# EAGLE design HMI_Board (EAGLE 7.7.0)
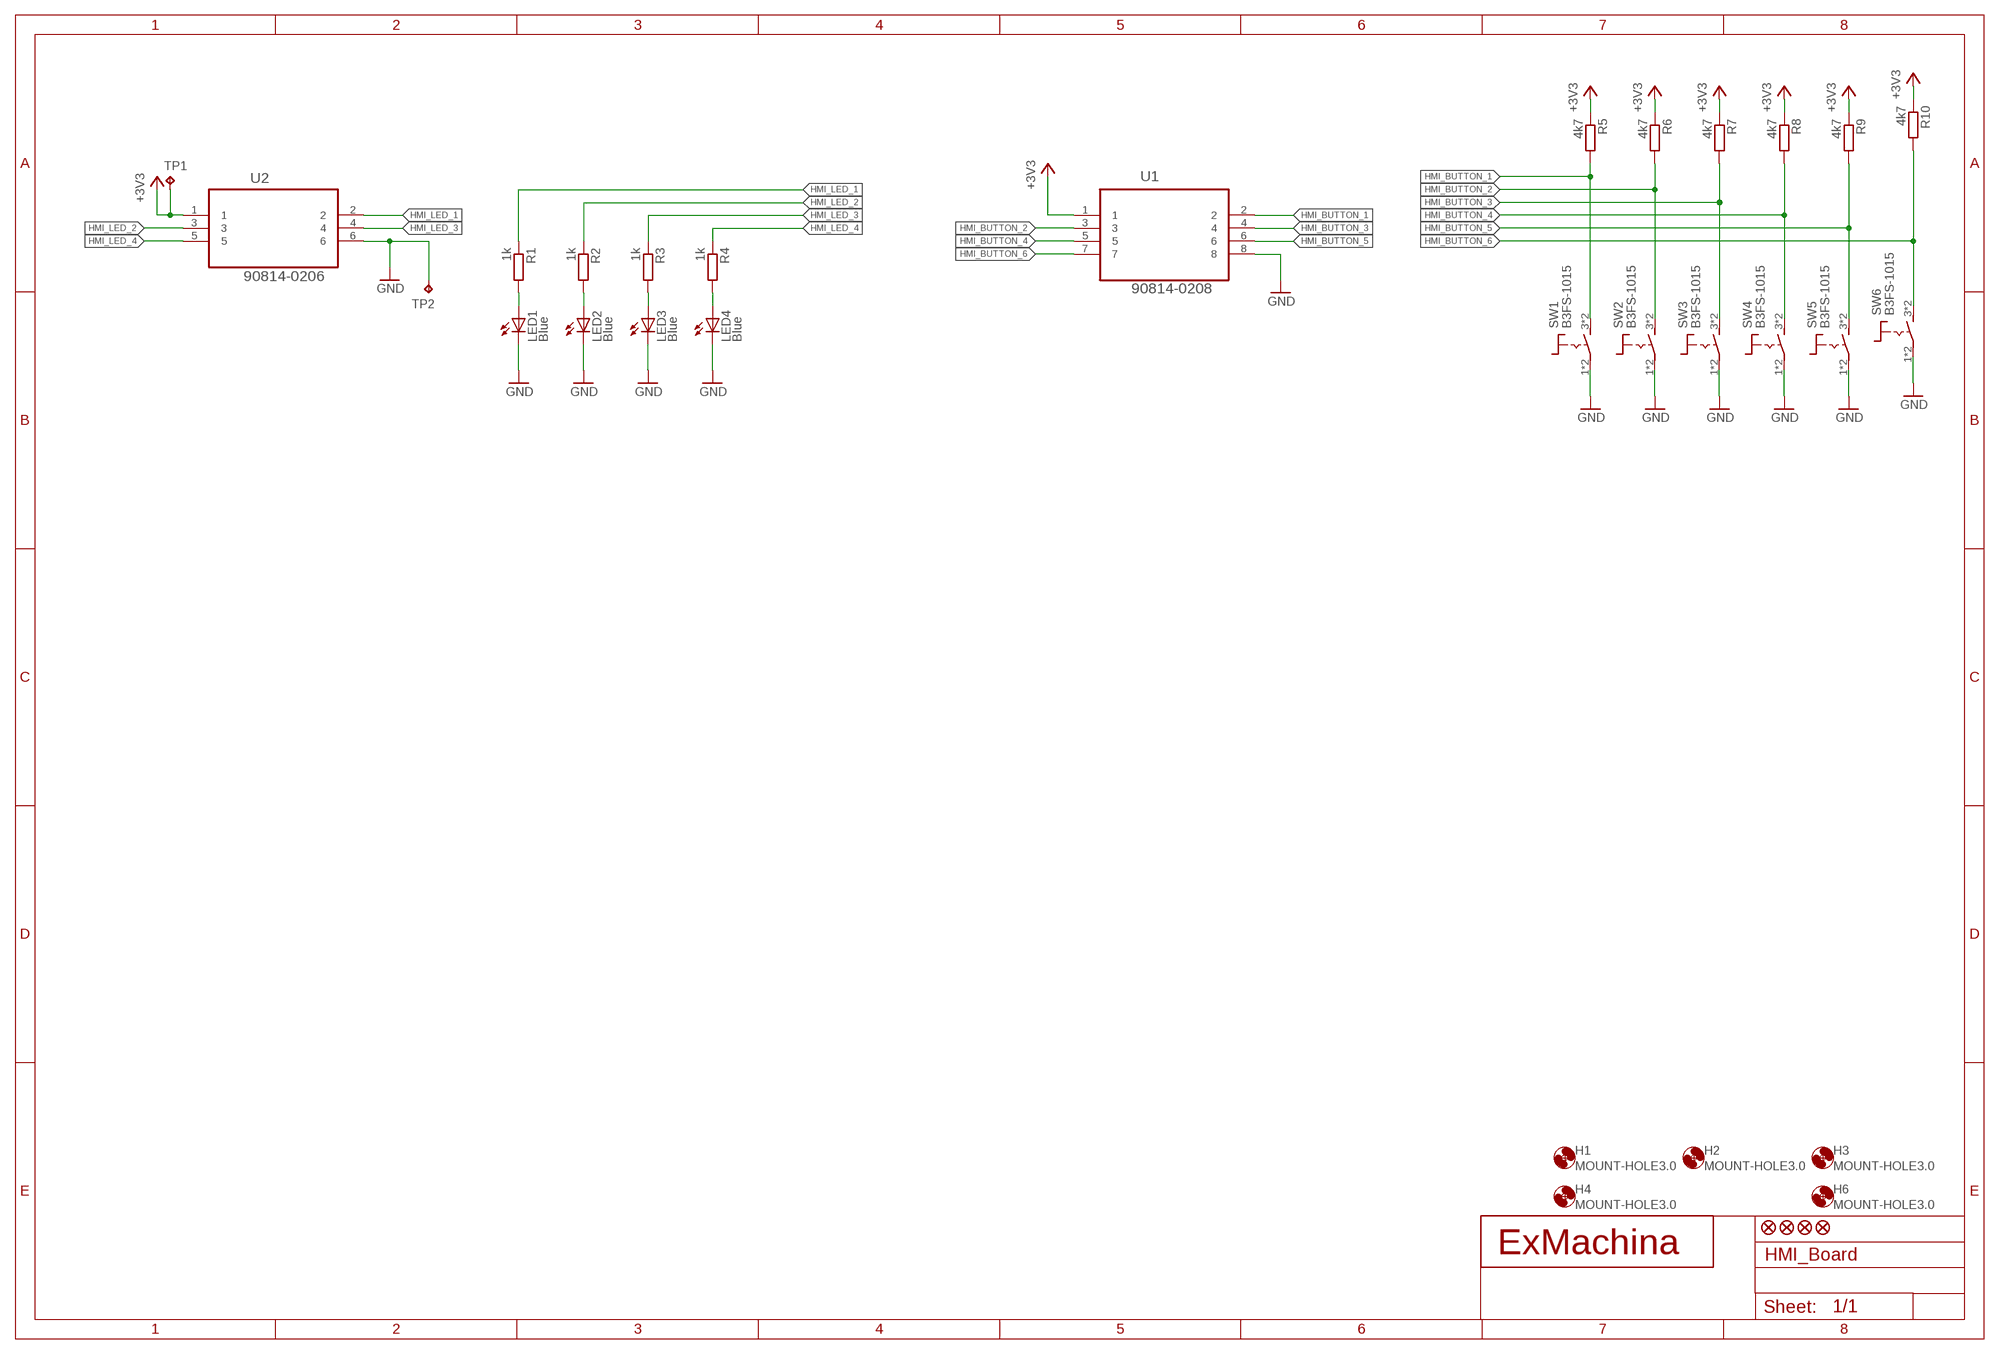
[diagram p0: schematic, sheet 1]

## Parts
H1  MOUNT-HOLE3.0  [3,0]
H2  MOUNT-HOLE3.0  [3,0]
H3  MOUNT-HOLE3.0  [3,0]
H4  MOUNT-HOLE3.0  [3,0]
H6  MOUNT-HOLE3.0  [3,0]
JP1  FIDUCIAL1X2  [FIDUCIAL-1X2]
JP2  FIDUCIAL1X2  [FIDUCIAL-1X2]
JP3  FIDUCIAL1X2  [FIDUCIAL-1X2]
JP4  FIDUCIAL1X2  [FIDUCIAL-1X2]
LED1  Blue  LEDSML0603  [SML0603]
LED2  Blue  LEDSML0603  [SML0603]
LED3  Blue  LEDSML0603  [SML0603]
LED4  Blue  LEDSML0603  [SML0603]
R1  1k  R-EU_R0603  [R0603]
R2  1k  R-EU_R0603  [R0603]
R3  1k  R-EU_R0603  [R0603]
R4  1k  R-EU_R0603  [R0603]
R5  4k7  R-EU_R0603  [R0603]
R6  4k7  R-EU_R0603  [R0603]
R7  4k7  R-EU_R0603  [R0603]
R8  4k7  R-EU_R0603  [R0603]
R9  4k7  R-EU_R0603  [R0603]
R10  4k7  R-EU_R0603  [R0603]
SW1  B3FS-1015  [B3FS]
SW2  B3FS-1015  [B3FS]
SW3  B3FS-1015  [B3FS]
SW4  B3FS-1015  [B3FS]
SW5  B3FS-1015  [B3FS]
SW6  B3FS-1015  [B3FS]
TP1  TPB2,54  [B2,54]
TP2  TPB2,54  [B2,54]
U1  90814-0208  [MOLEX_90814-0208]
U2  90814-0206  [MOLEX_90814-0206]
U$1  EXMACHINA-LOGO-NAME  [EXM-LOGO-BASELINE]

## Nets
+3V3: R5.1 R6.1 R7.1 R8.1 R9.1 R10.1 TP1.TP U1.1 U2.1
GND [supply]: LED1.C LED2.C LED3.C LED4.C SW1.1 SW1.2 SW2.1 SW2.2 SW3.1 SW3.2 SW4.1 SW4.2 SW5.1 SW5.2 SW6.1 SW6.2 TP2.TP U1.8 U2.6
HMI_BUTTON_1 [signal]: R5.2 SW1.3 SW1.4 U1.2
HMI_BUTTON_2 [signal]: R6.2 SW2.3 SW2.4 U1.3
HMI_BUTTON_3 [signal]: R7.2 SW3.3 SW3.4 U1.4
HMI_BUTTON_4 [signal]: R8.2 SW4.3 SW4.4 U1.5
HMI_BUTTON_5 [signal]: R9.2 SW5.3 SW5.4 U1.6
HMI_BUTTON_6 [signal]: R10.2 SW6.3 SW6.4 U1.7
HMI_LED_1 [signal]: R1.1 U2.2
HMI_LED_2 [signal]: R2.1 U2.3
HMI_LED_3 [signal]: R3.1 U2.4
HMI_LED_4 [signal]: R4.1 U2.5
N$1: LED1.A R1.2
N$2: LED2.A R2.2
N$3: LED3.A R3.2
N$4: LED4.A R4.2

## Library data of the parts
H1-H4 H6 = holes:MOUNT-HOLE: MOUNTING HOLE with drill center marker
JP1-JP4 = SparkFun:FIDUCIAL: Fiducial Alignment Points Various fiducial points for machine vision alignment.
LED1-LED4 = led:LED: LED OSRAM: - CHIPLED LG R971, LG N971, LY N971, LG Q971, LY Q971, LO R971, LY R971 LH N974, LH R974 LS Q976, LO Q976, LY Q976 LO Q996 - Hyper CHIPLED LW Q18S LB Q993, LB Q99A, LB R99A - SideLED LS A670, LO A670, LY A670, LG A670, LP A670 LB A673, LV A673, LT A673, LW A673 LH A674 LY A675 LS A676, LA A676, LO A676, LY A676, LW A676 LS A679, LY A679, LG A679 - Hyper Micro SIDELED® LS Y876, LA Y876, LO Y876, LY Y876 LT Y87S - SmartLED LW L88C, LW L88S LB L89C, LB L89S, LG L890 LS L89K, LO L89K, LY L89K LS L896, LA L896, LO L896, LY L896 - TOPLED LS T670, LO T670, LY T670, LG T670, LP T670 LSG T670, LSP T670, LSY T670, LOP T670, LYG T670 LG T671, LOG T671, LSG T671 LB T673, LV T673, LT T673, LW T673 LH T674 LS T676, LA T676, LO T676, LY T676, LB T676, LH T676, LSB T676, LW T676 LB T67C, LV T67C, LT T67C, LS T67K, LO T67K, LY T67K, LW E67C LS E67B, LA E67B, LO E67B, LY E67B, LB E67C, LV E67C, LT E67C LW T67C LS T679, LY T679, LG T679 LS T770, LO T770, LY T770, LG T770, LP T770 LB T773, LV T773, LT T773, LW T773 LH T774 LS E675, LA E675, LY E675, LS T675 LS T776, LA T776, LO T776, LY T776, LB T776 LHGB T686 LT T68C, LB T68C - Hyper Mini TOPLED® LB M676 - Mini TOPLED Santana® LG M470 LS M47K, LO M47K, LY M47K Source: http://www.osram.convergy.de LUXEON: - LUMILED® LXK2-PW12-R00, LXK2-PW12-S00, LXK2-PW14-U00, LXK2-PW14-V00 LXK2-PM12-R00, LXK2-PM12-S00, LXK2-PM14-U00 LXK2-PE12-Q00, LXK2-PE12-R00, LXK2-PE12-S00, LXK2-PE14-T00, LXK2-PE14-U00 LXK2-PB12-K00, LXK2-PB12-L00, LXK2-PB12-M00, LXK2-PB14-N00, LXK2-PB14-P00, LXK2-PB14-Q00 LXK2-PR12-L00, LXK2-PR12-M00, LXK2-PR14-Q00, LXK2-PR14-R00 LXK2-PD12-Q00, LXK2-PD12-R00, LXK2-PD12-S00 LXK2-PH12-R00, LXK2-PH12-S00 LXK2-PL12-P00, LXK2-PL12-Q00, LXK2-PL12-R00 Source: www.luxeon.com KINGBRIGHT: KA-3528ASYC Source: www.kingbright.com
R1-R10 = rcl:R-EU_: RESISTOR, European symbol
SW1-SW6 = Switch_SMT:B3FS: Surface-mounting Switches Ideal for High-density Mounting
TP1 TP2 = testpad:TP: Test pad
U1 = Molex_By_element14_Batch_1:90814-0208: CONN HEADER 8POS 1.27MM SMD TIN; MPN: 90814-0208; OC_FARNELL: 1757025; OC_NEWARK: 34R6216; PACKAGE: CONN-8POS; SUPPLIER: Molex
U2 = Molex_By_element14_Batch_1:90814-0206: CONN HEADER 06 POS 1.27MM SMD TIN; MPN: 90814-0206; OC_FARNELL: 1757024; OC_NEWARK: 34R6215; PACKAGE: CONN-6 POS; SUPPLIER: Molex
U$1 = exmachina:EXMACHINA-LOGO

## Net classes
1 signal: width 0.178 mm, drill 0.35 mm
2 supply: width 0.406 mm, drill 0.5 mm

## Board
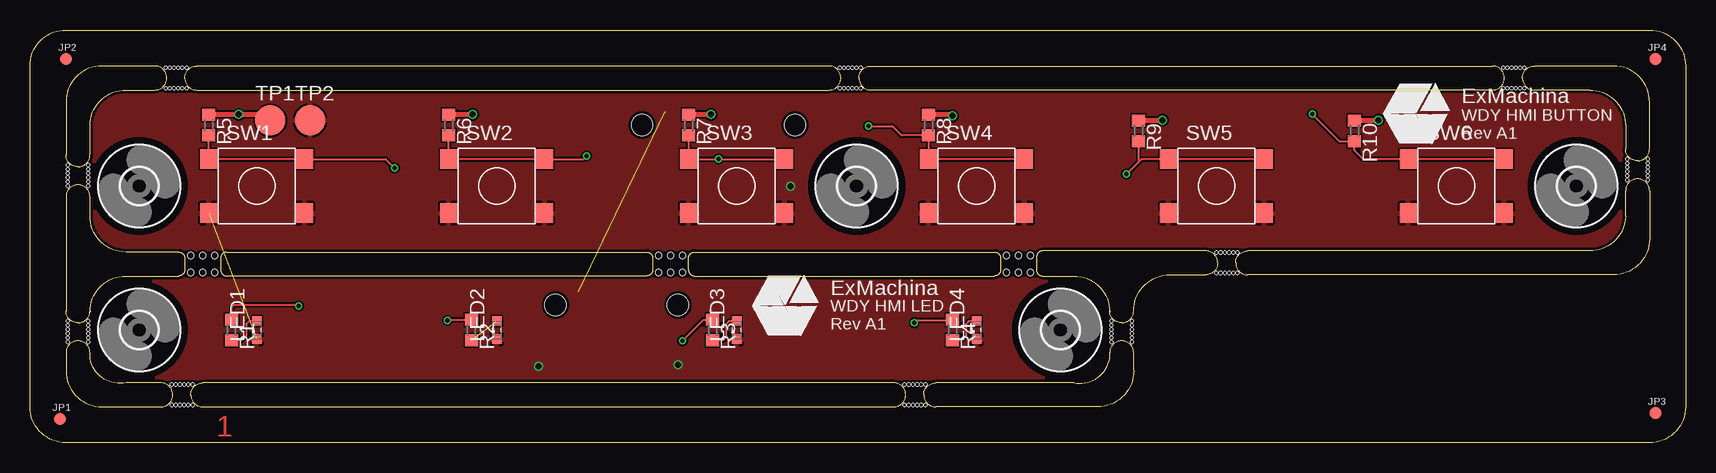
[diagram p1: board, top side]
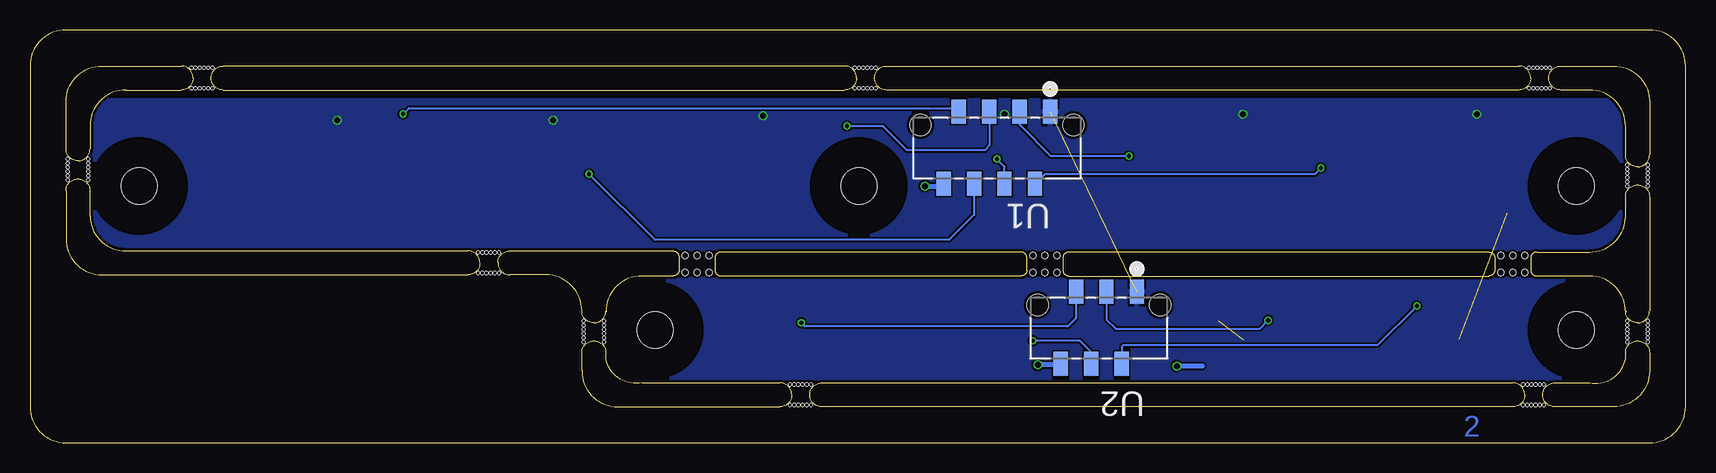
[diagram p2: board, bottom side, seen from below]

Size 138 x 34.4 mm. Coordinates in mm from the lower left corner, seen from the top.
Outline: 10.9,5 8,5 arc-90 5,7 5,7.5 arc90 4,8.5 arc90 3,7.5 3,6 arc90 6,3 10.9,3 arc90 11.9,4 arc90 10.9,5
Outline: 87,5 arc90 90,7 90,7.5 arc-90 91,8.5 arc-90 92,7.5 92,6 arc-90 89,3 75.5,3 arc-90 74.5,4 arc-90 75.5,5 87,5
Outline: 84.4,13.9 87,13.9 arc-90 90,10.9 90,11 arc90 91,10 arc90 92,11 arc-90 95,14 98,14 arc90 99,15 arc90 98,16 84.4,16 arc90 83.9,15.4 83.9,14.4 arc90 84.4,13.9
Outline: 15.9,15.4 15.9,14.4 arc90 16.4,13.9 51.4,13.9 arc90 51.9,14.4 51.9,15.4 arc90 51.4,15.9 16.4,15.9 arc90 15.9,15.4
Outline: 80.9,15.4 80.9,14.4 arc-90 80.4,13.9 55.4,13.9 arc-90 54.9,14.4 54.9,15.4 arc-90 55.4,15.9 80.4,15.9 arc-90 80.9,15.4
Outline: 133,18.9 arc-90 130,16 101.5,16 arc90 100.5,15 arc90 101.5,14 132,14 arc90 135,17 135,21 arc90 134,22 arc90 133,21 133,18.9
Outline: 12.9,15.4 12.9,14.4 arc-90 12.4,13.9 8,13.9 arc90 5,10.9 5,11 arc-90 4,10 arc-90 3,11 3,20.5 arc-90 4,21.5 arc-90 5,20.5 5,18.9 arc90 8,15.9 12.4,15.9 arc-90 12.9,15.4
Outline: 5,24 5,26.4 arc-90 8,29.4 10.4,29.4 arc90 11.4,30.4 arc90 10.4,31.4 6,31.4 arc90 3,28.4 3,24 arc90 4,23 arc90 5,24
Outline: 130,29.4 arc-90 133,26.4 133,24.5 arc90 134,23.5 arc90 135,24.5 135,28.4 arc90 132,31.4 125.4,31.4 arc90 124.4,30.4 arc90 125.4,29.4 130,29.4
Outline: 135,0 3,0 arc-90 0,3 0,31.4 arc-90 3,34.4 135,34.4 arc-90 138,31.4 138,3 arc-90 135,0
Outline: 13.4,4 arc-90 14.4,5 72,5 arc-90 73,4 arc-90 72,3 14.4,3 arc-90 13.4,4
Outline: 121.9,29.4 arc90 122.9,30.4 arc90 121.9,31.4 70.1,31.4 arc90 69.1,30.4 arc90 70.1,29.4 121.9,29.4
Outline: 12.9,30.4 arc-90 13.9,31.4 66.6,31.4 arc-90 67.6,30.4 arc-90 66.6,29.4 13.9,29.4 arc-90 12.9,30.4
Copper layers (1*16): Top 0.018mm / dielectric 1.55mm / Bottom 0.018mm
Design rules "eC_2Layer_PClass6_BaseCopperO18_eCDefault *": minimum track width 0.15mm, minimum drill 0.35mm, track to track 0.15mm, track to pad 0.15mm, pad to pad 0.15mm, via to via 0.15mm, smd to smd 0mil, copper to edge 0.25mm, drill to drill 0.35mm, minimum pad ring 0.175mm, minimum via ring 0.125mm, stop-mask expansion 0mil, vias tented up to drill 0.45mm, thermal gap 0.2mm
Holes 0.5 mm at 13.4,15.6 14.4,15.6 15.4,15.6 15.4,14.2 14.4,14.2 13.4,14.2 81.4,15.6 82.4,15.6 83.4,15.6 83.4,14.2 82.4,14.2 81.4,14.2 52.4,15.6 53.4,15.6 54.4,15.6 54.4,14.2 53.4,14.2 52.4,14.2
Holes 0.25 mm at 90.15,9.1 90.15,8.75 90.15,8.4 90.15,9.45 90.15,9.8 90.15,10.15 91.85,9.1 91.85,8.75 91.85,8.4 91.85,9.45 91.85,9.8 91.85,10.15 99.6,15.85 99.25,15.85 98.9,15.85 99.95,15.85 100.3,15.85 100.65,15.85 99.6,14.15 99.25,14.15 98.9,14.15 99.95,14.15 100.3,14.15 100.65,14.15 12.5,4.85 12.15,4.85 11.8,4.85 12.85,4.85 13.2,4.85 13.55,4.85 12.5,3.15 12.15,3.15 11.8,3.15 12.85,3.15 13.2,3.15 13.55,3.15 73.6,4.85 73.25,4.85 72.9,4.85 73.95,4.85 74.3,4.85 74.65,4.85 73.6,3.15 73.25,3.15 72.9,3.15 73.95,3.15 74.3,3.15 74.65,3.15 123.5,31.25 123.15,31.25 122.8,31.25 123.85,31.25 124.2,31.25 124.55,31.25 123.5,29.55 123.15,29.55 122.8,29.55 123.85,29.55 124.2,29.55 124.55,29.55 12,31.25 11.65,31.25 11.3,31.25 12.35,31.25 12.7,31.25 13.05,31.25 12,29.55 11.65,29.55 11.3,29.55 12.35,29.55 12.7,29.55 13.05,29.55 68.2,31.25 67.85,31.25 67.5,31.25 68.55,31.25 68.9,31.25 69.25,31.25 68.2,29.55 67.85,29.55 67.5,29.55 68.55,29.55 68.9,29.55 69.25,29.55 3.15,9.1 3.15,8.75 3.15,8.4 3.15,9.45 3.15,9.8 3.15,10.15 4.85,9.1 4.85,8.75 4.85,8.4 4.85,9.45 4.85,9.8 4.85,10.15 3.15,22.1 3.15,21.75 3.15,21.4 3.15,22.45 3.15,22.8 3.15,23.15 4.85,22.1 4.85,21.75 4.85,21.4 4.85,22.45 4.85,22.8 4.85,23.15 133.15,22.6 133.15,22.25 133.15,21.9 133.15,22.95 133.15,23.3 133.15,23.65 134.85,22.6 134.85,22.25 134.85,21.9 134.85,22.95 134.85,23.3 134.85,23.65

### Footprints (pad centres in the part's own frame; a part is rotated, then mirrored left to right if it is on the bottom)
3,0 = hole 3: 0,0
FIDUCIAL-1X2 = smd 1 x 1: 1 0,0
SML0603 = smd 0.8 x 0.8: A 0.75,0; C -0.75,0
R0603 = smd 1 x 1.1: 1 -0.85,0; 2 0.85,0
B3FS = smd 1.4 x 1.6: 1 4,-2.25; 2 -4,-2.25; 3 4,2.25; 4 -4,2.25
B2,54 = smd 2.54 x 2.54: TP 0,0
MOLEX_90814-0208 = smd 1.194 x 2.007: 1 -4.445,-3.175; 2 -3.175,2.819; 3 -1.905,-3.175; 4 -0.635,2.819; 5 0.635,-3.175; 6 1.905,2.819; 7 3.175,-3.175; 8 4.445,2.819 | hole 1.753: -6.375,-2.083; 6.375,-2.083
MOLEX_90814-0206 = smd 1.194 x 2.007: 1 -3.175,-3.175; 2 -1.905,2.819; 3 -0.635,-3.175; 4 0.635,2.819; 5 1.905,-3.175; 6 3.175,2.819 | hole 1.753: -5.105,-2.083; 5.105,-2.083

### Placement (x,y rotation side)
H1  128.9,21.4 0 top
H2  68.9,21.4 0 top
H3  9.1,9.4 0 top
H4  85.9,9.4 0 top
H6  9.1,21.4 0 top
JP1  2.5,2 0 top
JP2  3,32 0 top
JP3  135.5,2.5 0 top
JP4  135.5,32 0 top
LED1  18.9,9.4 90 top
LED2  38.9,9.4 90 top
LED3  58.9,9.4 90 top
LED4  78.9,9.4 90 top
R1  16.8,9.4 270 top
R2  36.8,9.4 270 top
R3  56.9,9.4 270 top
R4  76.9,9.4 270 top
R5  14.9,26.47 270 top
R6  34.9,26.47 270 top
R7  54.9,26.47 270 top
R8  74.9,26.47 270 top
R9  92.4,26 270 top
R10  110.4,26 270 top
SW1  18.9,21.4 0 top
SW2  38.9,21.4 0 top
SW3  58.9,21.4 0 top
SW4  78.9,21.4 0 top
SW5  98.9,21.4 0 top
SW6  118.9,21.4 0 top
TP1  20.04,26.86 0 top
TP2  23.35,26.86 0 top
U1  57.4,24.4 180 bottom
U2  48.9,9.4 180 bottom
U$1  62.9,11.4 0 top
U$2  EXMACHINA-LOGO-NAME  [EXM-LOGO-BASELINE]  115.5,27.4 0 top

### Tracks (layer width: path | path; a pad name or v marks a point on that pad's centre or on a via)
+3V3  (via drill 0.5)  (1 unrouted)
  Top 0.406: R5.1 14.95,27.37 v17.4,27.37 20.04,27.37 TP1.TP | R6.1 34.95,27.37 v36.9,27.37 | R10.1 110.45,26.9 v112.4,26.9 | R9.1 92.45,26.9 v94.4,26.9 | R8.1 74.95,27.37 76.77,27.37 v76.9,27.24 | R7.1 54.95,27.37 v56.77,27.37
  pour Bottom: -1.5,28.5 133,28.5 133,-11.5 -2,-11.5 -1.5,12
GND  (via drill 0.5)  (1 unrouted)
  Bottom 0.406: 40.26,6.4 v42.4,6.4 | v63.4,21.4 62.03,21.4 U1.8 | U2.6 52.16,6.5 v54,6.5
  pour Top: 134,35.5 -4,37 -4.5,-15 133.5,-15
HMI_BUTTON_1  (via drill 0.35)
  Top 0.178: R5.2 SW1.4 SW1.3 29.65,23.65 v30.4,22.9
  Bottom 0.178: v30.4,22.9 30.9,22.4 53.41,22.4 U1.2
HMI_BUTTON_2  (via drill 0.35)
  Top 0.178: R6.2 SW2.4 SW2.3 46.15,23.65 v46.4,23.9
  Bottom 0.178: v46.4,23.9 52.9,23.9 55.49,26.5 U1.3
HMI_BUTTON_3  (via drill 0.35)
  Top 0.178: R7.2 SW3.4 v57.4,23.65 SW3.3
  Bottom 0.178: U1.4 56.77,23.02 v57.4,23.65
HMI_BUTTON_4  (via drill 0.35)
  Top 0.178: SW4.3 SW4.4 R8.2 72.66,25.62 71.88,26.4 v69.9,26.4
  Bottom 0.178: v69.9,26.4 66.89,26.4 64.89,24.4 58.4,24.4 57.98,24.82 57.98,27.52 U1.5
HMI_BUTTON_5  (via drill 0.35)
  Top 0.178: SW5.3 SW5.4 92.65,23.65 92.4,23.4 | 92.4,23.4 v91.4,22.4 | R9.2 92.4,23.4
  Bottom 0.178: v91.4,22.4 85.91,16.91 61.4,16.91 59.3,19 U1.6
HMI_BUTTON_6  (via drill 0.35)
  Top 0.178: SW6.3 SW6.4 111.15,23.65 110.4,24.4 R10.2 109.15,25.15 v106.9,27.4
  Bottom 0.178: v106.9,27.4 106.4,27.9 60.9,27.9 U1.7
HMI_LED_1  (via drill 0.35)
  Top 0.178: R1.1 16.8,11.3 17,11.5 22.3,11.5 v22.4,11.4
  Bottom 0.178: v22.4,11.4 25.67,8.13 46.87,8.13 47,8 U2.2
HMI_LED_2  (via drill 0.35)
  Top 0.178: v34.8,10.2 34.85,10.25 R2.1
  Bottom 0.178: U2.3 48.27,10.27 47.5,9.5 35.5,9.5 v34.8,10.2
HMI_LED_3  (via drill 0.35)
  Top 0.178: v54.4,8.5 56.15,10.25 R3.1
  Bottom 0.178: U2.4 49.53,7.54 50.5,8.5 v54.4,8.5
HMI_LED_4  (via drill 0.35)
  Top 0.178: 76.9,10.6 R4.1 76.85,10.2 73.9,10.2 v73.7,10
  Bottom 0.178: U2.5 50.8,10.39 51.5,9.7 73.4,9.7 v73.7,10
N$1
  Top 0.178: LED1.A 18.25,10.15 18,9.9 18,8.9 17.65,8.55 R1.2
N$2  (1 unrouted)
N$3
  Top 0.178: LED3.A 58.25,10.15 58,9.9 58,8.8 57.75,8.55 R3.2
N$4
  Top 0.178: LED4.A 78.25,10.15 78,9.9 78,8.9 77.65,8.55 R4.2

### Text on the board
Top: 1
Bottom: 2
tPlace: WDY HMI BUTTON / Rev A1 | WDY HMI LED / Rev A1